# EAGLE design miniadsb (EAGLE 6.1)
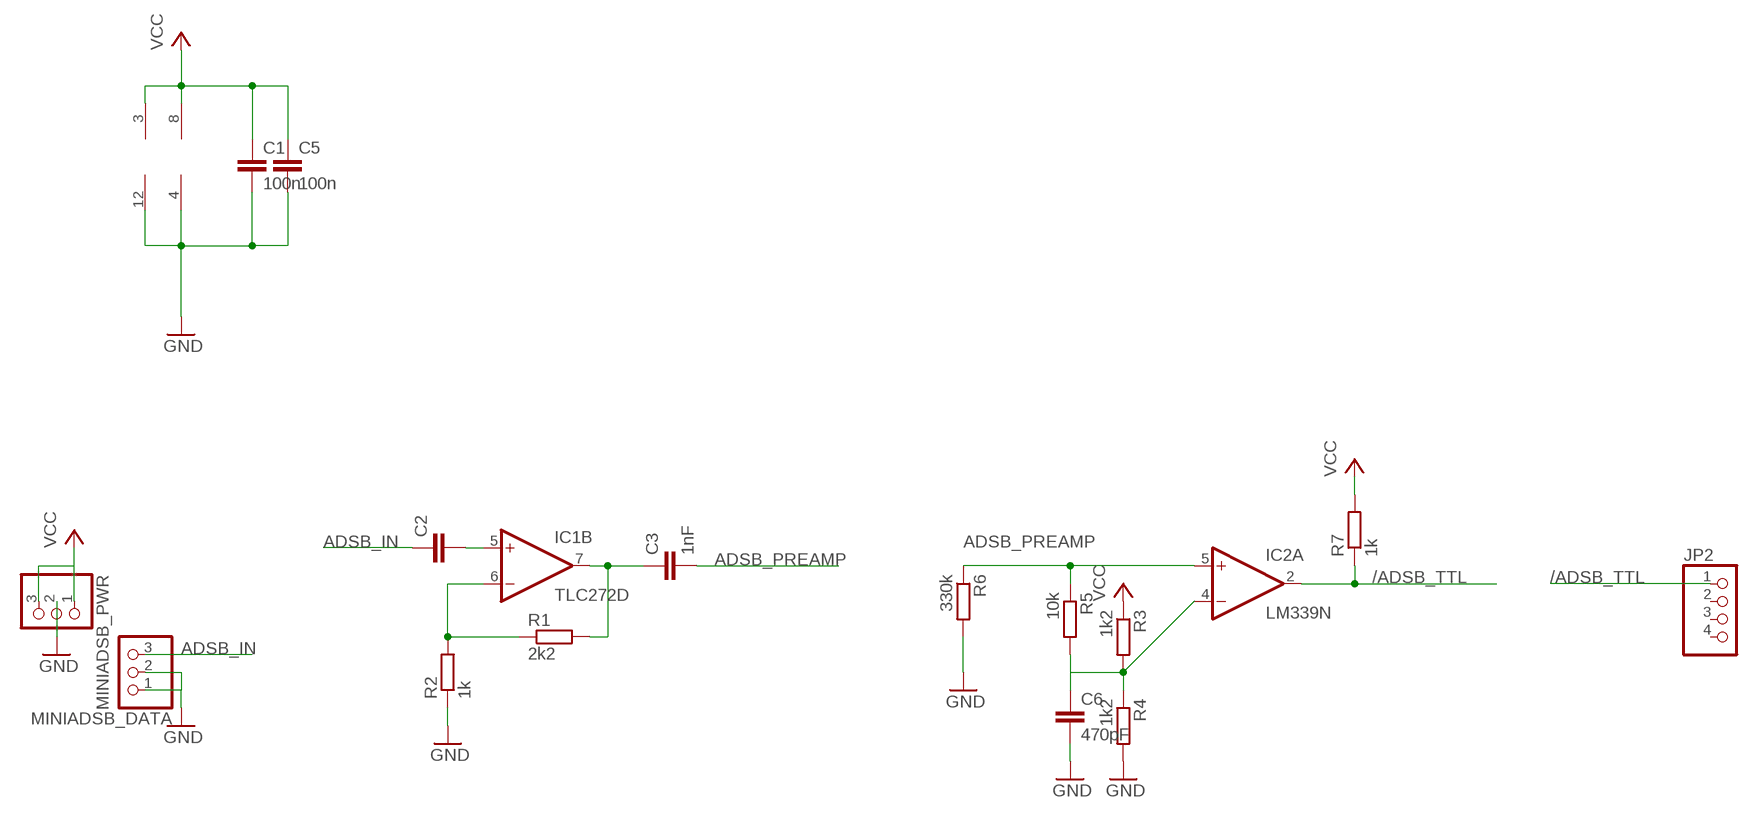
[diagram p0: schematic, sheet 1]

## Parts
C1  100n  C-EUC0805  [C0805]
C2  C-EUC0805  [C0805]
C3  1nF  C-EUC0805  [C0805]
C5  100n  C-EUC0805  [C0805]
C6  470pF  C-EUC0805  [C0805]
IC1  TLC272D  [SO08]
IC2  LM339N  [DIL14]
JP2  PINHD-1X4  [1X04]
MINIADSB_DATA  PINHD-1X3  [1X03]
MINIADSB_PWR  PINHD-1X3  [1X03]
R1  2k2  R-EU_R0805  [R0805]
R2  1k  R-EU_R0805  [R0805]
R3  1k2  R-EU_R0805  [R0805]
R4  1k2  R-EU_R0805  [R0805]
R5  10k  R-EU_R0805  [R0805]
R6  330k  R-EU_R0805  [R0805]
R7  1k  R-EU_R0603  [R0603]

## Nets
/ADSB_TTL: IC2.2(A:OUT) JP2.1 R7.1
ADSB_IN: C2.1 MINIADSB_DATA.3
ADSB_PREAMP: C3.2 IC2.5(A:+IN) R5.1 R6.1
GND: C1.2 C5.2 C6.2 IC1.4(P:V-) IC2.12(P:GND) MINIADSB_DATA.1 MINIADSB_DATA.2 MINIADSB_PWR.2 R2.1 R4.2 R6.2
N$1: C2.2 IC1.5(B:+IN)
N$2: C3.1 IC1.7(B:OUT) R1.2
N$3: IC1.6(B:-IN) R1.1 R2.2
N$5: C6.1 IC2.4(A:-IN) R3.2 R4.1 R5.2
VCC: C1.1 C5.1 IC1.8(P:V+) IC2.3(P:V+) MINIADSB_PWR.1 MINIADSB_PWR.3 R3.1 R7.2
Unconnected: IC1.1(A:OUT) IC1.2(A:-IN) IC1.3(A:+IN) IC2.1(B:OUT) IC2.6(B:-IN) IC2.7(B:+IN) IC2.8(C:-IN) IC2.9(C:+IN) IC2.10(D:-IN) IC2.11(D:+IN) IC2.13(D:OUT) IC2.14(C:OUT) JP2.2 JP2.3 JP2.4

## Library data of the parts
C1-C3 C5 C6 = resistor:C-EU: CAPACITOR, European symbol
IC1 = linear:TLC272: OP AMP
IC2 = linear:LM339: Low Power Low Offset Voltage Quad Comparators with open collector; LM139/LM239/LM339/LM2901/LM3302
JP2 = pinhead:PINHD-1X4: PIN HEADER
MINIADSB_DATA MINIADSB_PWR = pinhead:PINHD-1X3: PIN HEADER
R1-R6 = resistor:R-EU_: RESISTOR, European symbol
R7 = rcl:R-EU_: RESISTOR, European symbol

## Board
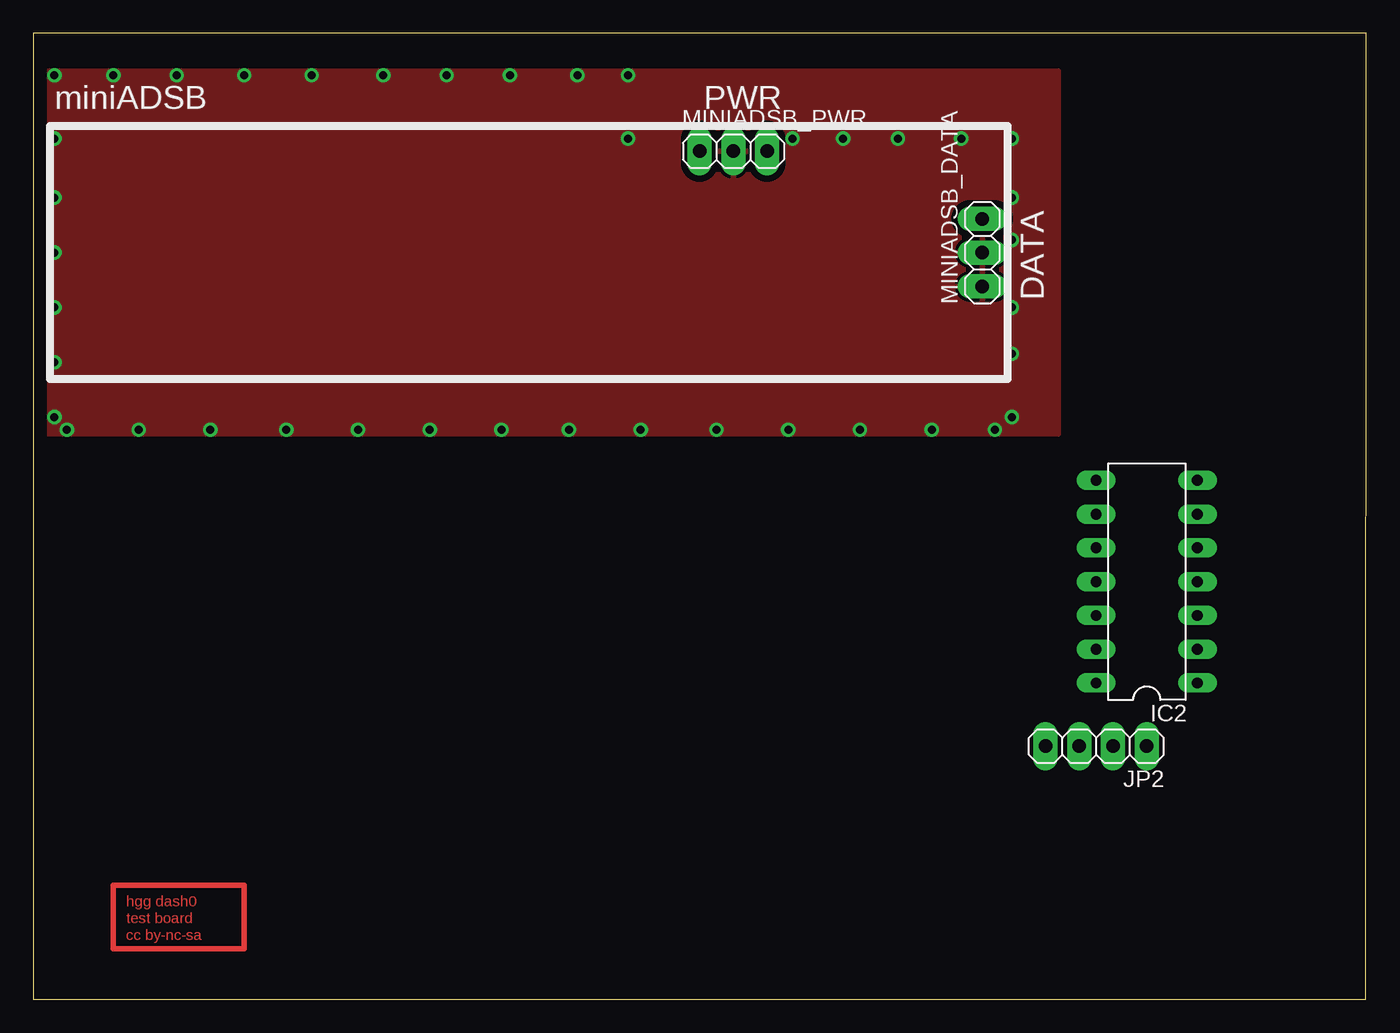
[diagram p1: board, top side]
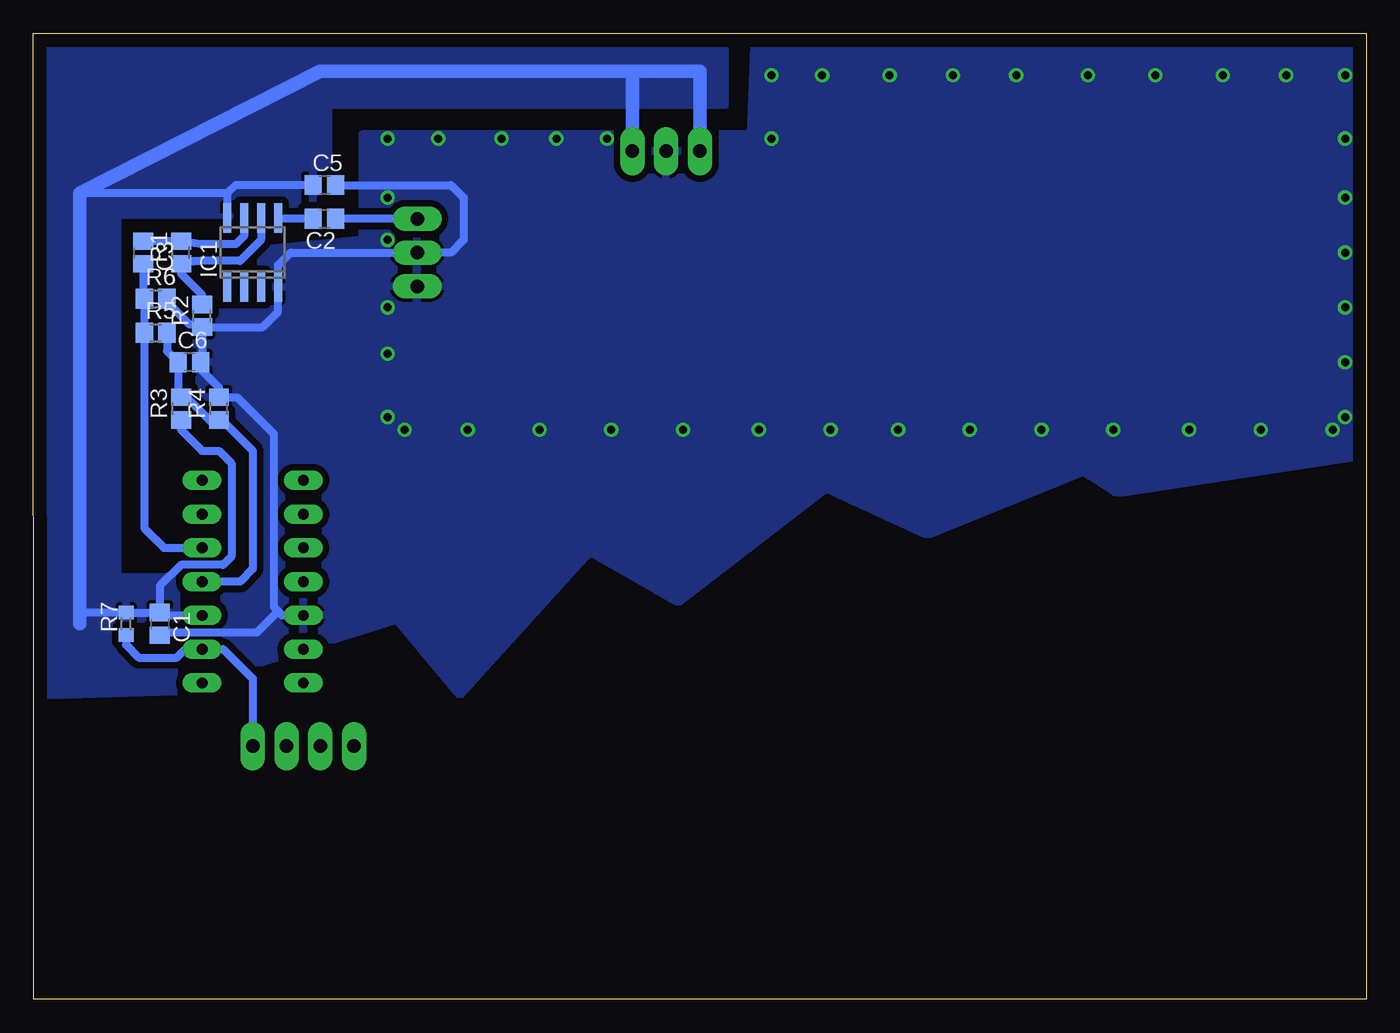
[diagram p2: board, bottom side, seen from below]

Size 100.34 x 72.7 mm. Coordinates in mm from the lower left corner, seen from the top.
Outline: 0,0 100.32,0 100.34,72.69 0,72.7 0,0
Copper layers (1*16): Top 0.035mm / dielectric 1.5mm / Bottom 0.035mm
Design rules "default *": minimum track width 10mil, minimum drill 20mil, track to track 8mil, track to pad 8mil, pad to pad 8mil, via to via 8mil, smd to smd 8mil, copper to edge 40mil, drill to drill 8mil, minimum pad ring 10mil, minimum via ring 8mil, stop-mask expansion 4mil, vias tented up to drill 0mil, thermal gap 10mil

### Footprints (pad centres in the part's own frame; a part is rotated, then mirrored left to right if it is on the bottom)
C0805 = smd 1.3 x 1.5: 1 -0.85,0; 2 0.85,0
SO08 = smd 0.6 x 2.2: 1 -1.905,-2.6; 2 -0.635,-2.6; 3 0.635,-2.6; 4 1.905,-2.6; 5 1.905,2.6; 6 0.635,2.6; 7 -0.635,2.6; 8 -1.905,2.6
DIL14 = drill 0.813 long: 1 -7.62,-3.81; 2 -5.08,-3.81; 3 -2.54,-3.81; 4 0,-3.81; 5 2.54,-3.81; 6 5.08,-3.81; 7 7.62,-3.81; 8 7.62,3.81; 9 5.08,3.81; 10 2.54,3.81; 11 0,3.81; 12 -2.54,3.81; 13 -5.08,3.81; 14 -7.62,3.81
1X04 = drill 1.016 long: 1 -3.81,0; 2 -1.27,0; 3 1.27,0; 4 3.81,0
1X03 = drill 1.016 long: 1 -2.54,0; 2 0,0; 3 2.54,0
R0805 = smd 1.3 x 1.5: 1 -0.85,0; 2 0.85,0
R0603 = smd 1 x 1.1: 1 -0.85,0; 2 0.85,0

### Placement (x,y rotation side)
C1  90.81,28.26 270 bottom
C2  78.42,58.74 180 bottom
C3  92.08,56.2 270 bottom
C5  78.42,61.28 0 bottom
C6  88.58,47.94 0 bottom
IC1  83.82,56.2 0 bottom
IC2  83.82,31.43 90 top
JP2  80.01,19.05 180 top
MINIADSB_DATA  71.44,56.2 90 top
MINIADSB_PWR  52.7,63.82 0 top
R1  89.22,56.2 90 bottom
R2  87.63,51.44 90 bottom
R3  89.22,44.45 90 bottom
R4  86.36,44.45 90 bottom
R5  91.12,50.16 0 bottom
R6  91.12,52.7 0 bottom
R7  93.34,28.26 90 bottom

### Tracks (layer width: path | path; a pad name or v marks a point on that pad's centre or on a via)
/ADSB_TTL
  Bottom 0.61: R7.1 93.34,26.67 92.39,25.72 89.53,25.72 88.9,26.35 IC2.2 86.04,26.35 83.82,24.13 JP2.1
ADSB_IN
  Bottom 0.61: MINIADSB_DATA.3 C2.1
ADSB_PREAMP
  Bottom 0.61: C3.2 92.08,52.81 R6.1 R5.1 91.97,35.46 90.49,33.97 IC2.5
GND  (via drill 0.6)
  Bottom 0.61: C5.2 68.9,61.28 67.94,60.33 67.94,57.15 68.9,56.2 MINIADSB_DATA.2 80.96,56.2 81.92,55.24 IC1.4 81.92,51.75 83.08,50.59 R2.1 | R6.2 90.49,52.7 88.58,50.8 87.84,50.8 R2.1 | R2.1 87.63,48.05 C6.2 87.73,47.41 86.36,46.04 R4.2 84.99,45.3 82.23,42.55 82.23,29.53 81.92,29.21 | 81.92,29.21 81.6,28.89 IC2.12 | C1.2 90.59,27.62 83.5,27.62 81.92,29.21
  other vias: 1.59,69.53 15.88,69.53 10.79,69.53 6.03,69.53 73.66,60.33 72.39,42.86 20.95,69.53 26.35,69.53 31.11,69.53 35.88,69.53 40.96,69.53 44.77,69.53 44.77,64.77 57.15,64.77 60.96,64.77 65.09,64.77 69.85,64.77 73.66,64.77 73.66,57.15 73.66,52.07 73.66,48.58 73.66,43.81 67.63,42.86 62.23,42.86 56.83,42.86 51.44,42.86 45.72,42.86 40.32,42.86 35.24,42.86 29.84,42.86 24.45,42.86 19.05,42.86 13.34,42.86 7.94,42.86 2.54,42.86 1.59,43.81 1.59,47.94 1.59,52.07 1.59,56.2 1.59,60.33 1.59,64.77
  pour Top (isolate 0.5): 0,69.85 77.15,69.85 77.15,42.55 0,42.55
  pour Bottom (isolate 0.5): 0,72.71 46.04,72.71 46.35,65.09 75.56,65.09 75.56,57.15 88.58,55.88 86.04,24.45 73.03,28.57 68.26,22.86 58.42,33.66 51.75,29.84 40.64,38.42 33.02,34.92 21.27,39.69 18.73,38.1 0,40.96
N$1
  Bottom 0.61: C2.2 81.86,58.74 IC1.5
N$2
  Bottom 0.61: IC1.7 84.45,57.47 85.09,56.83 87.73,56.83 R1.2 C3.1
N$3
  Bottom 0.61: IC1.6 83.19,57.15 84.77,55.56 87.73,55.56 | 87.73,55.56 R1.1 | R2.2 87.63,53.02 89.22,54.61 89.22,55.56 87.73,55.56
N$4
  Top 0.406: 6.03,8.57 15.88,8.57 15.88,3.81 6.03,3.81 6.03,8.57
N$5
  Bottom 0.61: R5.2 90.27,48.78 C6.1 89.43,45.52 R3.2 88.8,45.3 87,43.5 86.46,43.5 | 86.46,43.5 R4.1 | 86.46,43.5 86.04,43.5 83.82,41.27 83.82,32.38 84.77,31.43 IC2.4
VCC
  Bottom 0.61: C5.1 85.09,61.28 85.72,60.64 | 85.72,60.64 IC1.8 | R3.1 89.22,42.86 87.63,41.27 86.36,41.27 85.41,40.32 85.41,33.34 86.04,32.7 89.22,32.7 90.81,31.11 90.81,29.21 | 90.81,29.21 90.49,28.89 IC2.3 | 90.81,29.21 C1.1 R7.2 96.42,29.11 96.84,29.53 | 85.72,60.64 96.84,60.64
  Bottom 1.016: MINIADSB_PWR.1 50.16,69.85 55.24,69.85 | MINIADSB_PWR.3 55.24,69.85 | 55.24,69.85 78.74,69.85 96.84,60.64 96.84,29.53 96.84,28.26
  pour Bottom (isolate 0.5): 48.26,72.71 100.33,72.71 100.33,22.86 89.53,23.18 89.53,31.75 93.98,31.75 93.98,59.05 78.11,59.05 78.11,67.31 48.26,67.31

### Text on the board
Top: hgg dash0 | test board | cc by-nc-sa
tPlace: miniADSB | PWR | DATA